# Altium project creative2016.PrjPCB
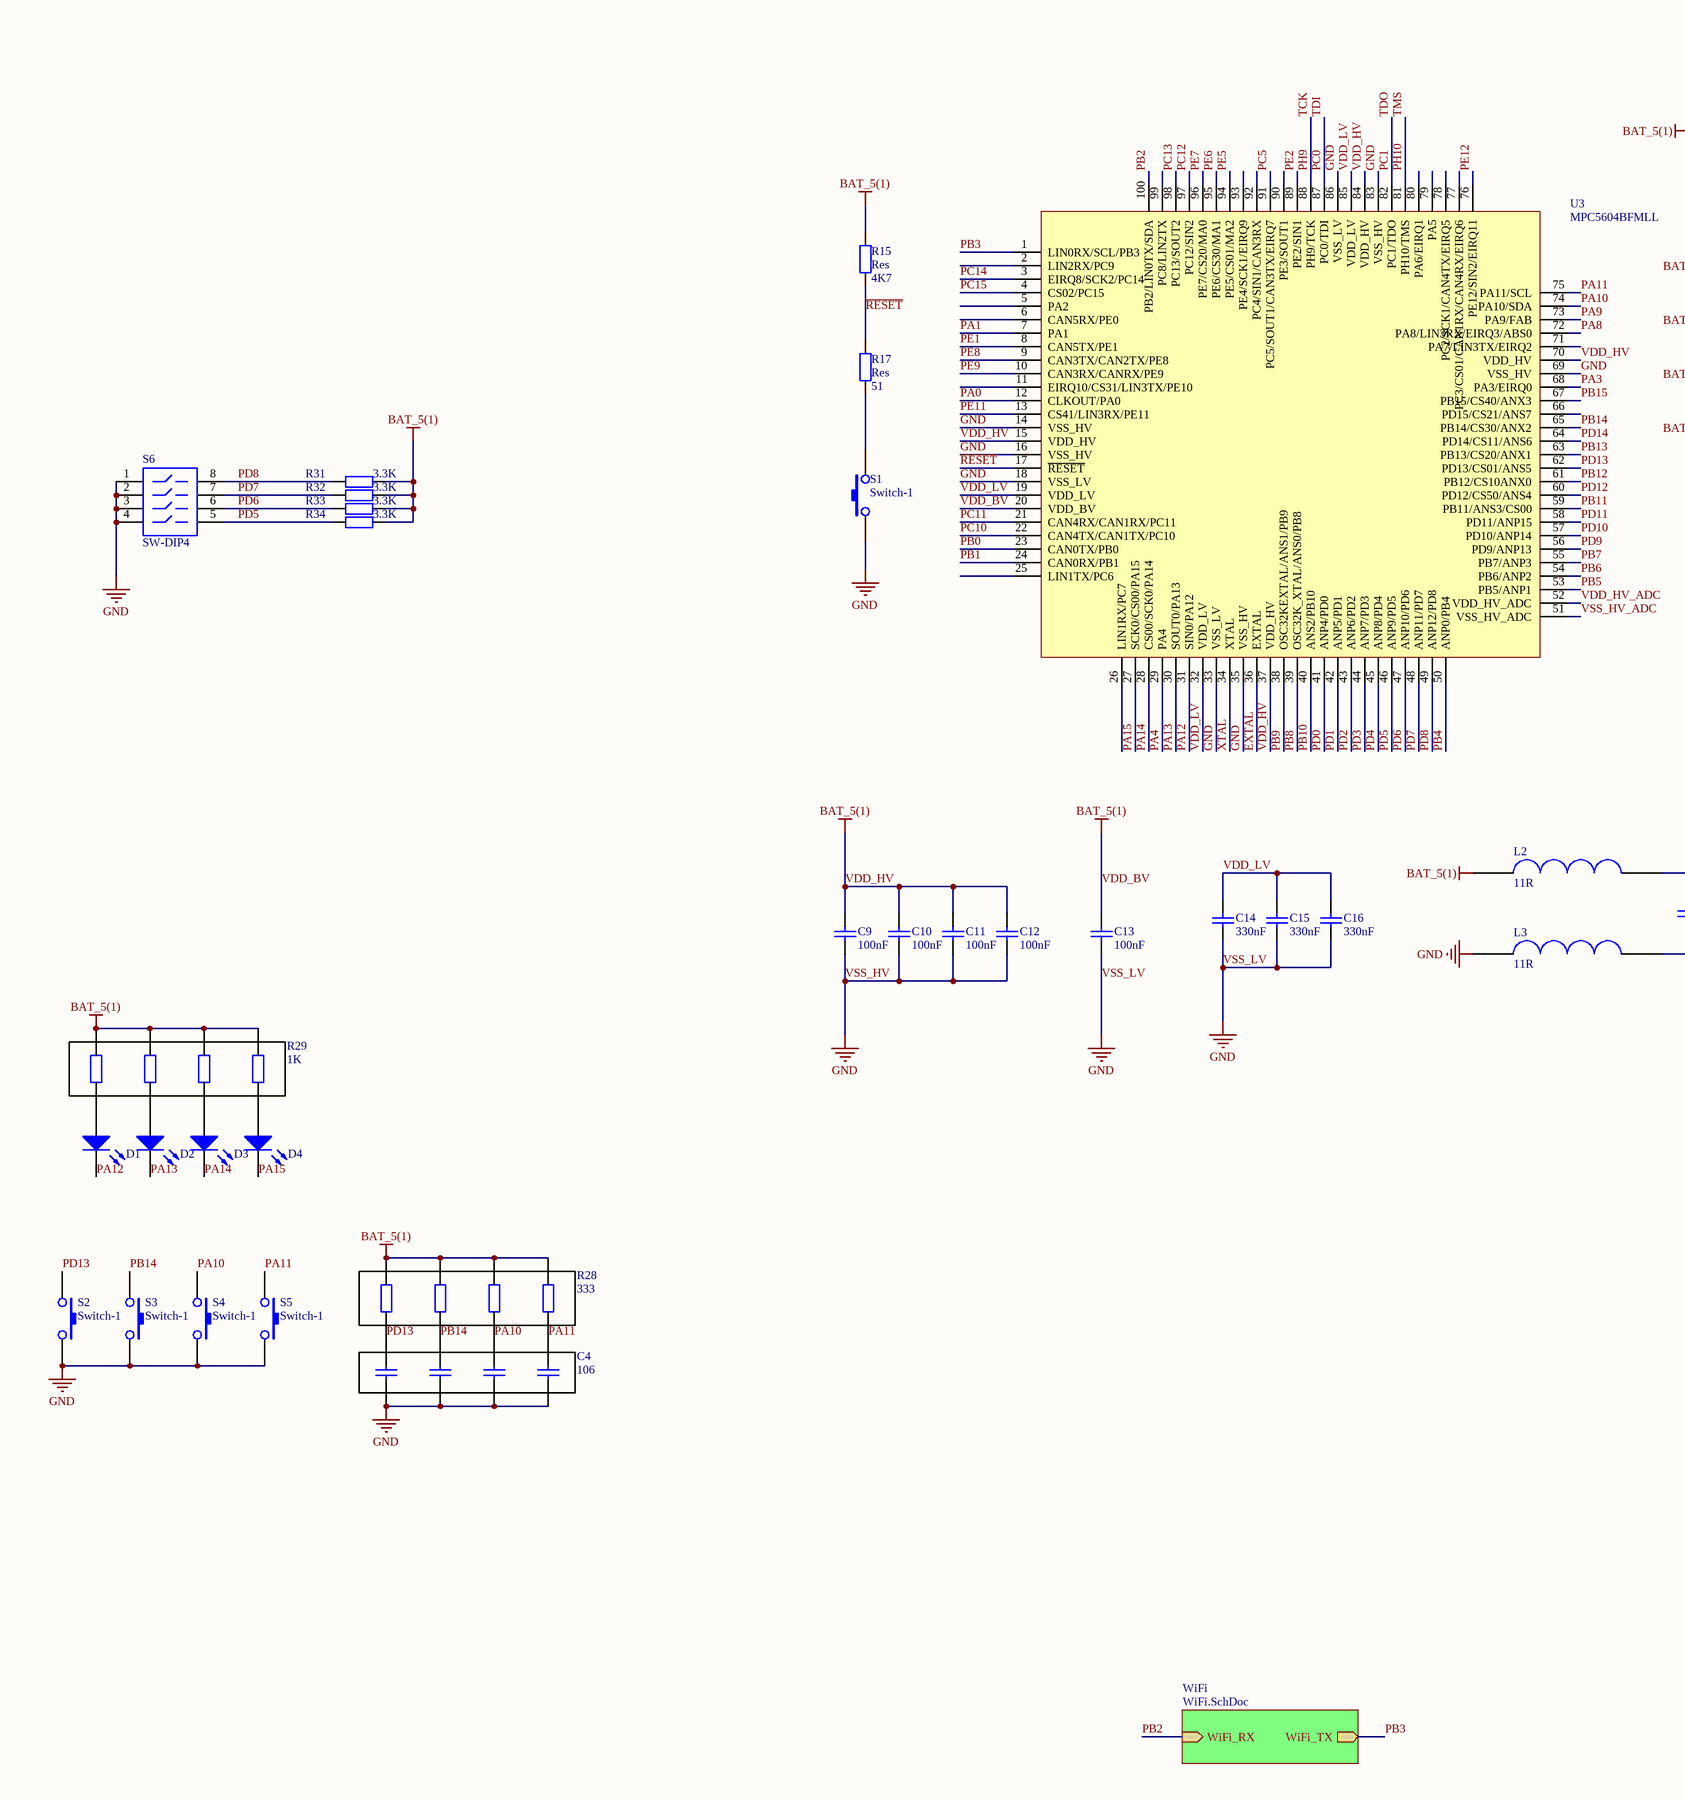
[diagram p0: Total.SchDoc, left]
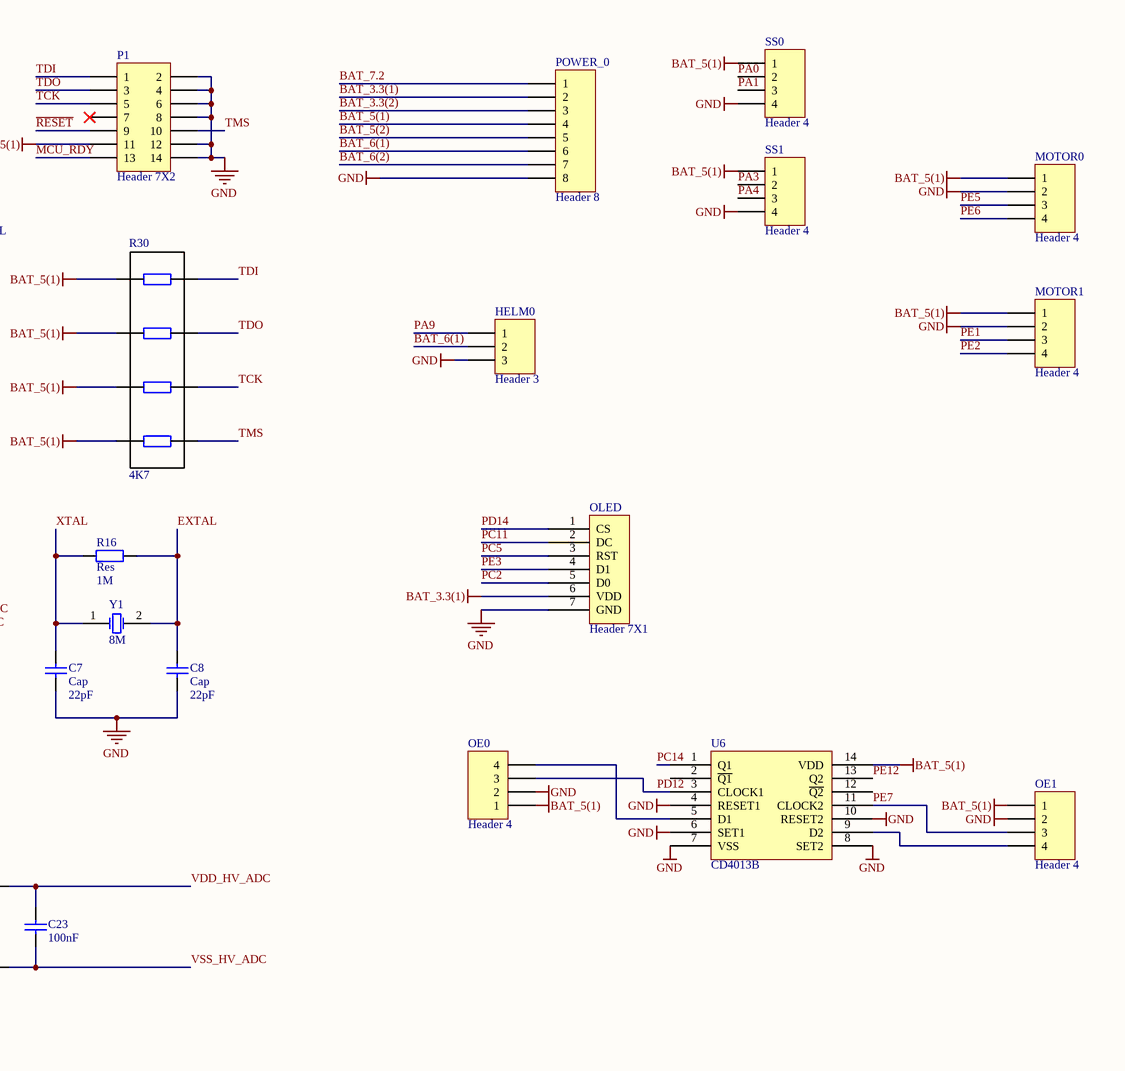
[diagram p1: Total.SchDoc, right]
2 sheets, 56 parts. Net scope: hierarchical (ports join the sheet entries above them; power ports are global).
Board file: creative2016.PcbDoc
Sheets:
  Total.SchDoc
    WiFi = WiFi.SchDoc

## Sheet Total.SchDoc
size A2

### Parts
C4  value 106  [8P4R-0603]  (hidden comment: Cap x4)
C7  Cap  value 22pF  [0805 2]
C8  Cap  value 22pF  [0805 2]
C9  value 100nF  [0805 2]  (hidden comment: Cap)
C10  value 100nF  [0805 2]  (hidden comment: Cap)
C11  value 100nF  [0805 2]  (hidden comment: Cap)
C12  value 100nF  [0805 2]  (hidden comment: Cap)
C13  value 100nF  [0805 2]  (hidden comment: Cap)
C14  value 330nF  [0805 2]  (hidden comment: Cap)
C15  value 330nF  [0805 2]  (hidden comment: Cap)
C16  value 330nF  [0805 2]  (hidden comment: Cap)
C23  value 100nF  [0805 2]  (hidden comment: Cap)
D1  LED  [0805 Pol 3]  (value not drawn)
D2  LED  [0805 Pol 3]  (value not drawn)
D3  LED  [0805 Pol 3]  (value not drawn)
D4  LED  [0805 Pol 3]  (value not drawn)
HELM0  Header 3  [HDR1X3]
L2  value 11R  [0805 2]  (hidden comment: Bead)
L3  value 11R  [0805 2]  (hidden comment: Bead)
MOTOR0  Header 4  [HDR1X4]
MOTOR1  Header 4  [HDR1X4]
OE0  Header 4  [HDR1X4]
OE1  Header 4  [HDR1X4]
OLED  Header 7X1  [OLED-chiusir]
P1  Header 7X2  [Header 2X7]
POWER_0  Header 8  [XH2.54_8]
R15  Res  value 4K7  [0805 2]
R16  Res  value 1M  [0805 2]
R17  Res  value 51  [0805 2]
R28  value 333  [8P4R-0603]  (hidden comment: R x4)
R29  value 1K  [8P4R-0603]  (hidden comment: R x4)
R30  value 4K7  [8P4R-0603]  (hidden comment: R x4)
R31  value 3.3K  [0805 2]  (hidden comment: Res2)
R32  value 3.3K  [0805 2]  (hidden comment: Res2)
R33  value 3.3K  [0805 2]  (hidden comment: Res2)
R34  value 3.3K  [0805 2]  (hidden comment: Res2)
S1  Switch-1  [햐뇰객숩]
S2  Switch-1  [햐뇰객숩]
S3  Switch-1  [햐뇰객숩]
S4  Switch-1  [햐뇰객숩]
S5  Switch-1  [햐뇰객숩]
S6  SW-DIP4  [Switch_4]
SS0  Header 4  [HDR1X4]
SS1  Header 4  [HDR1X4]
U3  MPC5604BFMLL  [LQ_LQFP100]
U6  CD4013B  [TSOP-14]
Y1  value 8M  [5032 2]  (hidden comment: XTAL)

### Sub-sheets
WiFi = WiFi.SchDoc: WiFi_RX (in), WiFi_TX (out)

### Nets
BAT_3.3(1): OLED.6(VDD) POWER_0.2
BAT_5(1): C9.2 C10.2 C11.2 C12.2 C13.2 L2.1 MOTOR0.1 MOTOR1.1 OE0.1 OE1.1 P1.11 POWER_0.4 R15.2 R28.1 R28.3 R28.5 R28.7 R29.1 R29.3 R29.5 R29.7 R30.2 R30.4 R30.6 R30.8 R31.1 R32.1 R33.1 R34.1 SS0.1 SS1.1 U3.15(VDD_HV) U3.20(VDD_BV) U3.37(VDD_HV) U3.70(VDD_HV) U3.84(VDD_HV) U6.14(VDD)  [also labelled VDD_BV, VDD_HV]
GND: C4.2 C4.4 C4.6 C4.8 C7.1 C8.1 C9.1 C10.1 C11.1 C12.1 C13.1 C14.1 C15.1 C16.1 HELM0.3 L3.1 MOTOR0.2 MOTOR1.2 OE0.2 OE1.2 OLED.7(GND) P1.2 P1.4 P1.6 P1.8 P1.12 P1.14 POWER_0.8 S1.1 S2.2 S3.2 S4.2 S5.2 S6.1 S6.2 S6.3 S6.4 SS0.4 SS1.4 U3.14(VSS_HV) U3.16(VSS_HV) U3.18(VSS_LV) U3.33(VSS_LV) U3.35(VSS_HV) U3.69(VSS_HV) U3.83(VSS_HV) U3.86(VSS_LV) U6.4(RESET1) U6.6(SET1) U6.7(VSS) U6.8(SET2) U6.10(RESET2)  [also labelled VSS_HV, VSS_LV]
BAT_3.3(2): POWER_0.3
BAT_5(2): POWER_0.5
BAT_6(1): HELM0.2 POWER_0.6
BAT_6(2): POWER_0.7
BAT_7.2: POWER_0.1
EXTAL: C8.2 R16.1 U3.36(EXTAL) Y1.2(OSC2)
MCU_RDY: P1.13
PA0: SS0.2 U3.12(CLKOUT/PA0)
PA1: SS0.3 U3.7(PA1)
PA3: SS1.2 U3.68(PA3/EIRQ0)
PA4: SS1.3 U3.29(PA4)
PA8: U3.72(PA8/LIN3RX/EIRQ3/ABS0)
PA9: HELM0.1 U3.73(PA9/FAB)
PA10: C4.5 R28.6 S4.1 U3.74(PA10/SDA)
PA11: C4.7 R28.8 S5.1 U3.75(PA11/SCL)
PA12: D1.2(K) U3.31(SIN0/PA12)
PA13: D2.2(K) U3.30(SOUT0/PA13)
PA14: D3.2(K) U3.28(CS00/SCK0/PA14)
PA15: D4.2(K) U3.27(SCK0/CS00/PA15)
PB0: U3.23(CAN0TX/PB0)
PB1: U3.24(CAN0RX/PB1)
PB2: U3.100(PB2/LIN0TX/SDA) ; sheet WiFi/WiFi_RX
PB3: U3.1(LIN0RX/SCL/PB3) ; sheet WiFi/WiFi_TX
PB4: U3.50(ANP0/PB4)
PB5: U3.53(PB5/ANP1)
PB6: U3.54(PB6/ANP2)
PB7: U3.55(PB7/ANP3)
PB8: U3.39(OSC32K_XTAL/ANS0/PB8)
PB9: U3.38(OSC32KEXTAL/ANS1/PB9)
PB10: U3.40(ANS2/PB10)
PB11: U3.59(PB11/ANS3/CS00)
PB12: U3.61(PB12/CS10ANX0)
PB13: U3.63(PB13/CS20/ANX1)
PB14: C4.3 R28.4 S3.1 U3.65(PB14/CS30/ANX2)
PB15: U3.67(PB15/CS40/ANX3)
PC0: P1.1 R30.1 U3.87(PC0/TDI)  [also labelled TDI]
PC1: P1.3 R30.3 U3.82(PC1/TDO)  [also labelled TDO]
PC2: OLED.5(D0)
PC5: OLED.3(RST) U3.91(PC5/SOUT1/CAN3TX/EIRQ7)
PC10: U3.22(CAN4TX/CAN1TX/PC10)
PC11: OLED.2(DC) U3.21(CAN4RX/CAN1RX/PC11)
PC12: U3.97(PC12/SIN2)
PC13: U3.98(PC13/SOUT2)
PC14: U3.3(EIRQ8/SCK2/PC14) U6.1(Q1)
PC15: U3.4(CS02/PC15)
PD0: U3.41(ANP4/PD0)
PD1: U3.42(ANP5/PD1)
PD2: U3.43(ANP6/PD2)
PD3: U3.44(ANP7/PD3)
PD4: U3.45(ANP8/PD4)
PD5: R34.2 S6.5 U3.46(ANP9/PD5)
PD6: R33.2 S6.6 U3.47(ANP10/PD6)
PD7: R32.2 S6.7 U3.48(ANP11/PD7)
PD8: R31.2 S6.8 U3.49(ANP12/PD8)
PD9: U3.56(PD9/ANP13)
PD10: U3.57(PD10/ANP14)
PD11: U3.58(PD11/ANP15)
PD12: OE0.3 U3.60(PD12/CS50/ANS4) U6.3(CLOCK1)
PD13: C4.1 R28.2 S2.1 U3.62(PD13/CS01/ANS5)
PD14: OLED.1(CS) U3.64(PD14/CS11/ANS6)
PE1: MOTOR1.3 U3.8(CAN5TX/PE1)
PE2: MOTOR1.4 U3.89(PE2/SIN1)
PE3: OLED.4(D1)
PE5: MOTOR0.3 U3.94(PE5/CS01/MA2)
PE6: MOTOR0.4 U3.95(PE6/CS30/MA1)
PE7: OE1.3 U3.96(PE7/CS20/MA0) U6.11(CLOCK2)
PE8: U3.9(CAN3TX/CAN2TX/PE8)
PE9: U3.10(CAN3RX/CANRX/PE9)
PE11: U3.13(CS41/LIN3RX/PE11)
PE12: U3.76(PE12/SIN2/EIRQ11) U6.13(Q2)
PH9: P1.5 R30.5 U3.88(PH9/TCK)  [also labelled TCK]
PH10: P1.10 R30.7 U3.81(PH10/TMS)  [also labelled TMS]
~{RESET}: P1.9 R15.1 R17.2 U3.17(~{RESET})
VDD_HV_ADC: C23.2 L2.2 U3.52(VDD_HV_ADC)
VDD_LV: C14.2 C15.2 C16.2 U3.19(VDD_LV) U3.32(VDD_LV) U3.85(VDD_LV)
VSS_HV_ADC: C23.1 L3.2 U3.51(VSS_HV_ADC)
XTAL: C7.2 R16.2 U3.34(XTAL) Y1.1(OSC1)
NetD1_1: D1.1(A) R29.2
NetD2_1: D2.1(A) R29.4
NetD3_1: D3.1(A) R29.6
NetD4_1: D4.1(A) R29.8
NetOE0_4: OE0.4 U6.5(D1)
NetOE1_4: OE1.4 U6.9(D2)
NetR17_1: R17.1 S1.2

Not connected (* = marked no-connect by the designer): P1 7*; U3 2(LIN2RX/PC9) 5(PA2) 6(CAN5RX/PE0) 11(EIRQ10/CS31/LIN3TX/PE10) 25(LIN1TX/PC6) 26(LIN1RX/PC7) 66(PD15/CS21/ANS7) 71(PA7/LIN3TX/EIRQ2) 77(PC3/CS01/CAN1RX/CAN4RX/EIRQ6) 78(PC2/SCK1/CAN4TX/EIRQ5) 79(PA5) 80(PA6/EIRQ1) 90(PE3/SOUT1) 92(PC4/SIN1/CAN3RX) 93(PE4/SCK1/EIRQ9) 99(PC8/LIN2TX); U6 2(~{Q1}) 12(~{Q2})

### Library data of the parts
C7-C16 C23 = Cap: Capacitor; Published: 8-Jun-2000; LatestRevisionDate: 17-Jul-2002; LatestRevisionNote: Re-released for DXP Platform.; PackageReference: RAD-0.3; Publisher: Altium Limited; PackageDescription: Radial Cap, Thru-Hole; 2 Leads; 0.3 in Pin Spacing
HELM0 = Header 3: Header, 3-Pin; LatestRevisionDate: 17-Jul-2002; LatestRevisionNote: Re-released for DXP Platform.; Publisher: Altium Limited
MOTOR0 MOTOR1 OE0 OE1 SS0 SS1 = Header 4: Header, 4-Pin; LatestRevisionDate: 17-Jul-2002; LatestRevisionNote: Re-released for DXP Platform.; Publisher: Altium Limited
OLED = OLED-chiusir
P1 = Header 7X2: Header, 7-Pin, Dual row; LatestRevisionDate: 17-Jul-2002; LatestRevisionNote: Re-released for DXP Platform.; Publisher: Altium Limited
POWER_0 = Header 8: Header, 8-Pin; LatestRevisionDate: 17-Jul-2002; LatestRevisionNote: Re-released for DXP Platform.; Publisher: Altium Limited
R15-R17 = Res: Resistor; Published: 8-Jun-2000; LatestRevisionDate: 17-Jul-2002; LatestRevisionNote: Re-released for DXP Platform.; PackageReference: AXIAL-0.4; Publisher: Altium Limited; PackageDescription: Axial Device, Thru-Hole; 2 Leads; 0.4 in Pin Spacing
R28-R30 = Res x4
R31-R34 = Res2: Resistor; Published: 8-Jun-2000; LatestRevisionDate: 17-Jul-2002; LatestRevisionNote: Re-released for DXP Platform.; PackageReference: AXIAL-0.4; Publisher: Altium Limited
S6 = SWITCH-4
U6 = CD4013B: CMOS Dual 'D'-Type Flip-Flop
Y1 = XTAL: Crystal Oscillator; Published: 8-Jun-2000; LatestRevisionDate: 17-Jul-2002; LatestRevisionNote: Re-released for DXP Platform.; PackageReference: R38; Publisher: Altium Limited; PackageDescription: Crystal, Thru-Hole; 2 Leads; Body 3.1 x 8.2 mm (Dia.xH)

## Sheet WiFi.SchDoc
size A4
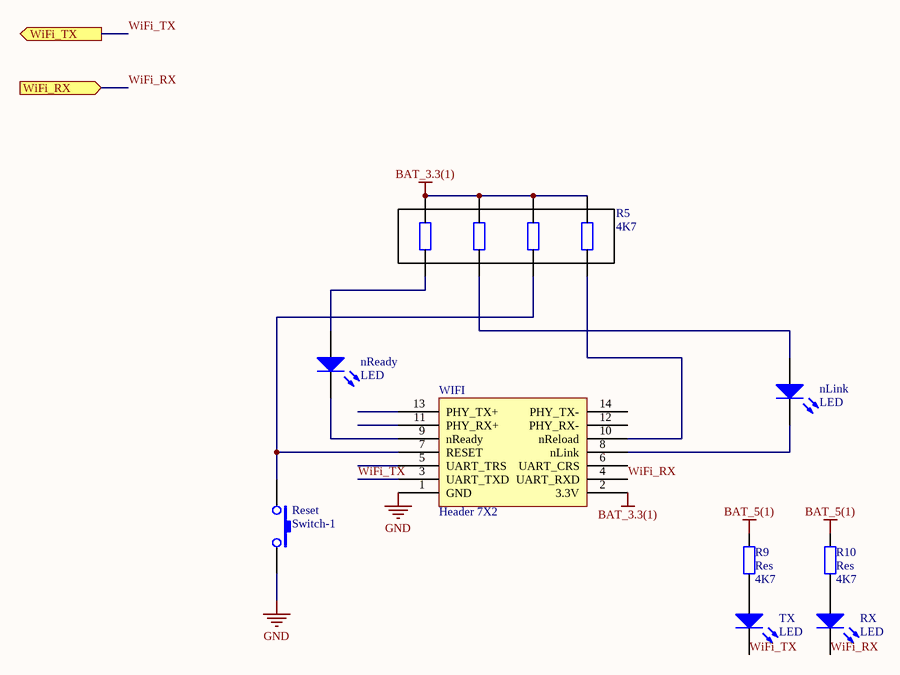
[diagram p2: WiFi.SchDoc]

### Parts
nLink  LED  [0805 2]
nReady  LED  [0805 2]
R5  value 4K7  [8P4R-0603]  (hidden comment: R x4)
R9  Res  value 4K7  [0805 2]
R10  Res  value 4K7  [0805 2]
Reset  Switch-1  [轻触按键]
RX  LED  [0805 2]
TX  LED  [0805 2]
WIFI  Header 7X2  [USR-WIFI232-X]

### Ports
WiFi_RX (in), WiFi_TX (out)

### Nets
BAT_3.3(1): R5.1 R5.3 R5.5 R5.7 WIFI.2(3.3V)
BAT_5(1): R9.2 R10.2
GND: Reset.2 WIFI.1(GND)
WiFi_RX: RX.2(K) WIFI.4(UART_RXD) ; port WiFi_RX  [project net PB2]
WiFi_TX: TX.2(K) WIFI.3(UART_TXD) ; port WiFi_TX  [project net PB3]
NetnLink_1: nLink.1(A) R5.4
NetnLink_2: nLink.2(K) WIFI.8(nLink)
NetnReady_1: nReady.1(A) R5.2
NetnReady_2: nReady.2(K) WIFI.9(nReady)
NetR5_6: R5.6 Reset.1 WIFI.7(RESET)
NetR5_8: R5.8 WIFI.10(nReload)
NetR9_1: R9.1 TX.1(A)
NetR10_1: R10.1 RX.1(A)

Not connected (* = marked no-connect by the designer): WIFI 5(UART_TRS) 6(UART_CRS) 11(PHY_RX+) 12(PHY_RX-) 13(PHY_TX+) 14(PHY_TX-)

### Library data of the parts
R5 = Res x4
R9 R10 = Res: Resistor; Published: 8-Jun-2000; LatestRevisionDate: 17-Jul-2002; LatestRevisionNote: Re-released for DXP Platform.; PackageReference: AXIAL-0.4; Publisher: Altium Limited; PackageDescription: Axial Device, Thru-Hole; 2 Leads; 0.4 in Pin Spacing
WIFI = USR-WIFI232-X

## Nets that join several sheets
BAT_3.3(1): Total (OLED.6 POWER_0.2), WiFi (5 pins)
BAT_5(1): Total (37 pins), WiFi (R9.2 R10.2)
GND: Total (52 pins), WiFi (Reset.2 WIFI.1)
PB2: Total (U3.100), WiFi (RX.2 WIFI.4)
PB3: Total (U3.1), WiFi (TX.2 WIFI.3)